# EAGLE design 16ch_omn_hirose_adapter (EAGLE 7.3.0)
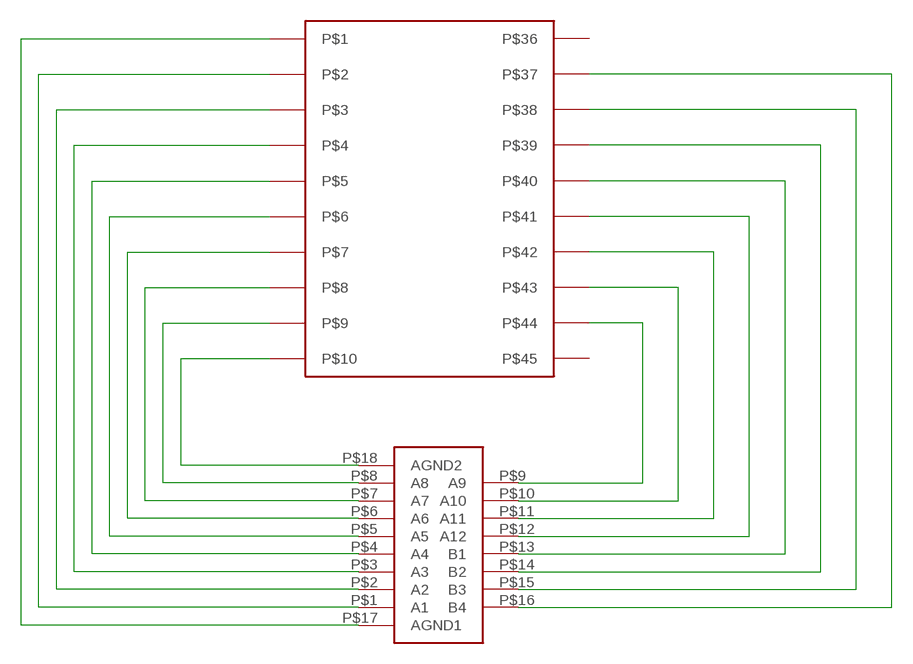
[diagram p0: schematic, sheet 1]

## Parts
U$1  HIROSE_DF40_70PIN  [HIROSE_DF40C-70DS]
U$2  OMNETICS_FE18  [OMNETICS_FE18]

## Nets
N$1: U$1.P$10 U$2.P$18(AGND2)
N$2: U$1.P$9 U$2.P$8(A8)
N$3: U$1.P$8 U$2.P$7(A7)
N$4: U$1.P$7 U$2.P$6(A6)
N$5: U$1.P$6 U$2.P$5(A5)
N$6: U$1.P$5 U$2.P$4(A4)
N$7: U$1.P$4 U$2.P$3(A3)
N$8: U$1.P$3 U$2.P$2(A2)
N$9: U$1.P$2 U$2.P$1(A1)
N$10: U$1.P$1 U$2.P$17(AGND1)
N$11: U$1.P$44 U$2.P$9(A9)
N$12: U$1.P$43 U$2.P$10(A10)
N$13: U$1.P$42 U$2.P$11(A11)
N$14: U$1.P$41 U$2.P$12(A12)
N$15: U$1.P$40 U$2.P$13(B1)
N$16: U$1.P$39 U$2.P$14(B2)
N$17: U$1.P$38 U$2.P$15(B3)
N$18: U$1.P$37 U$2.P$16(B4)
Unconnected: U$1.P$36 U$1.P$45

## Library data of the parts
U$1 = GG_hirose20:HIROSE_DF40_70PIN
U$2 = connectors:OMNETICS_FE18

## Board
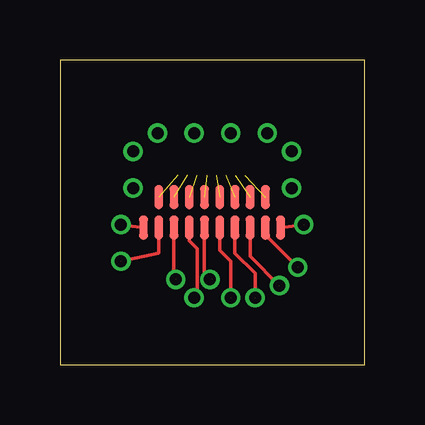
[diagram p1: board, top side]
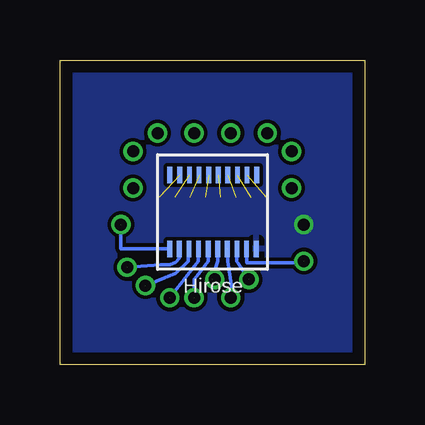
[diagram p2: board, bottom side, seen from below]

Size 12.7 x 12.7 mm. Coordinates in mm from the lower left corner, seen from the top.
Outline: 0,0 12.7,0 12.7,12.7 0,12.7 0,0
Copper layers (1*16): Top 0.035mm / dielectric 1.5mm / Bottom 0.035mm
Design rules "default *": minimum track width 6mil, minimum drill 15mil, track to track 6mil, track to pad 6mil, pad to pad 6mil, via to via 6mil, smd to smd 6mil, copper to edge 20mil, drill to drill 6mil, minimum pad ring 6mil, minimum via ring 6mil, stop-mask expansion 4mil, vias tented up to drill 0mil, thermal gap 10mil

### Footprints (pad centres in the part's own frame; a part is rotated, then mirrored left to right if it is on the bottom)
HIROSE_DF40C-70DS = smd 0.2 x 0.7: P$1 0,0; P$2 -0.4,0; P$3 -0.8,0; P$4 -1.2,0; P$5 -1.6,0; P$6 -2,0; P$7 -2.4,0; P$8 -2.8,0; P$9 -3.2,0; P$10 -3.6,0; P$36 0,-3.08; P$37 -0.42,-3.08; P$38 -0.82,-3.08; P$39 -1.22,-3.08; P$40 -1.62,-3.08; P$41 -2.02,-3.08; P$42 -2.42,-3.08; P$43 -2.82,-3.08; P$44 -3.22,-3.08; P$45 -3.62,-3.08
OMNETICS_FE18 = smd 0.381 x 1.016: P$1 -1.905,0.635; P$2 -1.27,0.635; P$3 -0.635,0.635; P$4 0,0.635; P$5 0.635,0.635; P$6 1.27,0.635; P$7 1.905,0.635; P$8 2.54,0.635; P$9 2.54,-0.635; P$10 1.905,-0.635; P$11 1.27,-0.635; P$12 0.635,-0.635; P$13 0,-0.635; P$14 -0.635,-0.635; P$15 -1.27,-0.635; P$16 -1.905,-0.635; P$17 -2.54,0.635; P$18 3.175,0.635

### Placement (x,y rotation side)
U$1  8.13,4.83 180 bottom
U$2  6.65,6.35 180 top

### Tracks (layer width: path | path; a pad name or v marks a point on that pad's centre or on a via)
N$1  (via drill 0.5 pad 0.41)
  Top 0.152: U$2.P$18 v2.54,5.84
  pour Bottom: 0,12.7 12.7,12.7 12.7,0 0,0
N$2  (1 unrouted)
  Top 0.152: U$2.P$8 4.11,4.66 4.1,4.65 2.54,4.32
  Bottom 0.152: U$1.P$9 4.93,4.24 2.54,4.24 2.54,4.32
N$3  (1 unrouted)
  Top 0.152: U$2.P$7 4.75,3.63 4.83,3.56
  Bottom 0.152: U$1.P$8 5.33,4.32 4.83,3.56
N$4  (1 unrouted)
  Top 0.152: U$2.P$6 5.38,5.17 U$1.P$7 5.73,2.93 5.59,2.79
  Bottom 0.152: U$1.P$7 5.71,4.83 5.71,4.32 5.47,2.79 5.59,2.79
N$5  (1 unrouted)
  Top 0.152: U$2.P$5 6.02,3.89 6.35,3.56
  Bottom 0.152: U$1.P$6 6.12,4.83 6.12,4.32 6.38,3.56 6.35,3.56
N$6  (1 unrouted)
  Top 0.152: U$2.P$4 6.66,4.78 7.11,4.32 7.11,2.79
  Bottom 0.152: U$1.P$5 6.53,4.32 6.86,3.89 7.11,3.56 7.11,2.79
N$7  (1 unrouted)
  Top 0.152: U$2.P$3 7.29,4.65 8.13,3.81 8.13,2.79
  Bottom 0.152: U$1.P$4 6.93,4.32 8.13,2.79
N$8  (1 unrouted)
  Top 0.152: U$2.P$2 7.92,4.52 9.14,3.3
  Bottom 0.152: U$1.P$3 7.37,4.32 7.87,3.81 9.14,3.3
N$9  (1 unrouted)
  Top 0.152: U$2.P$1 8.56,5.41 9.91,4.06
  Bottom 0.152: U$1.P$2 7.73,4.45 7.87,4.27 8.13,4.17 8.51,4.17 9.91,4.06
N$10  (1 unrouted)
  Top 0.152: U$2.P$17 10.16,5.84
  Bottom 0.152: U$1.P$1 10.16,4.83 10.16,5.84
N$11  (1 unrouted)
N$12  (1 unrouted)
N$13  (1 unrouted)
N$14  (1 unrouted)
N$15  (1 unrouted)
N$16  (1 unrouted)
N$17  (1 unrouted)
N$18  (1 unrouted)
N$19  (via drill 0.5 pad 0.41)
  other vias: 3.05,7.37
N$20  (via drill 0.5 pad 0.41)
  other vias: 3.05,8.89
N$21  (via drill 0.5 pad 0.41)
  other vias: 4.06,9.65
N$22  (via drill 0.5 pad 0.41)
  other vias: 5.59,9.65
N$23  (via drill 0.5 pad 0.41)
  other vias: 7.11,9.65
N$24  (via drill 0.5 pad 0.41)
  other vias: 8.64,9.65
N$25  (via drill 0.5 pad 0.41)
  other vias: 9.65,7.37
N$26  (via drill 0.5 pad 0.41)
  other vias: 9.65,8.89
N$28  (via drill 0.5 pad 0.41)
  other vias: 10.16,5.84
N$29  (via drill 0.5 pad 0.41)
  other vias: 7.11,2.79
N$30  (via drill 0.5 pad 0.41)
  other vias: 9.91,4.06
N$31  (via drill 0.5 pad 0.41)
  other vias: 9.14,3.3
N$32  (via drill 0.5 pad 0.41)
  other vias: 8.13,2.79
N$33  (via drill 0.5 pad 0.41)
  other vias: 6.25,3.56
N$34  (via drill 0.5 pad 0.41)
  other vias: 5.59,2.79
N$35  (via drill 0.5 pad 0.41)
  other vias: 4.83,3.56
N$36  (via drill 0.5 pad 0.41)
  other vias: 2.54,4.32